# EAGLE schematic TeslaBMS_Shield_5 (EAGLE 7.7.0)
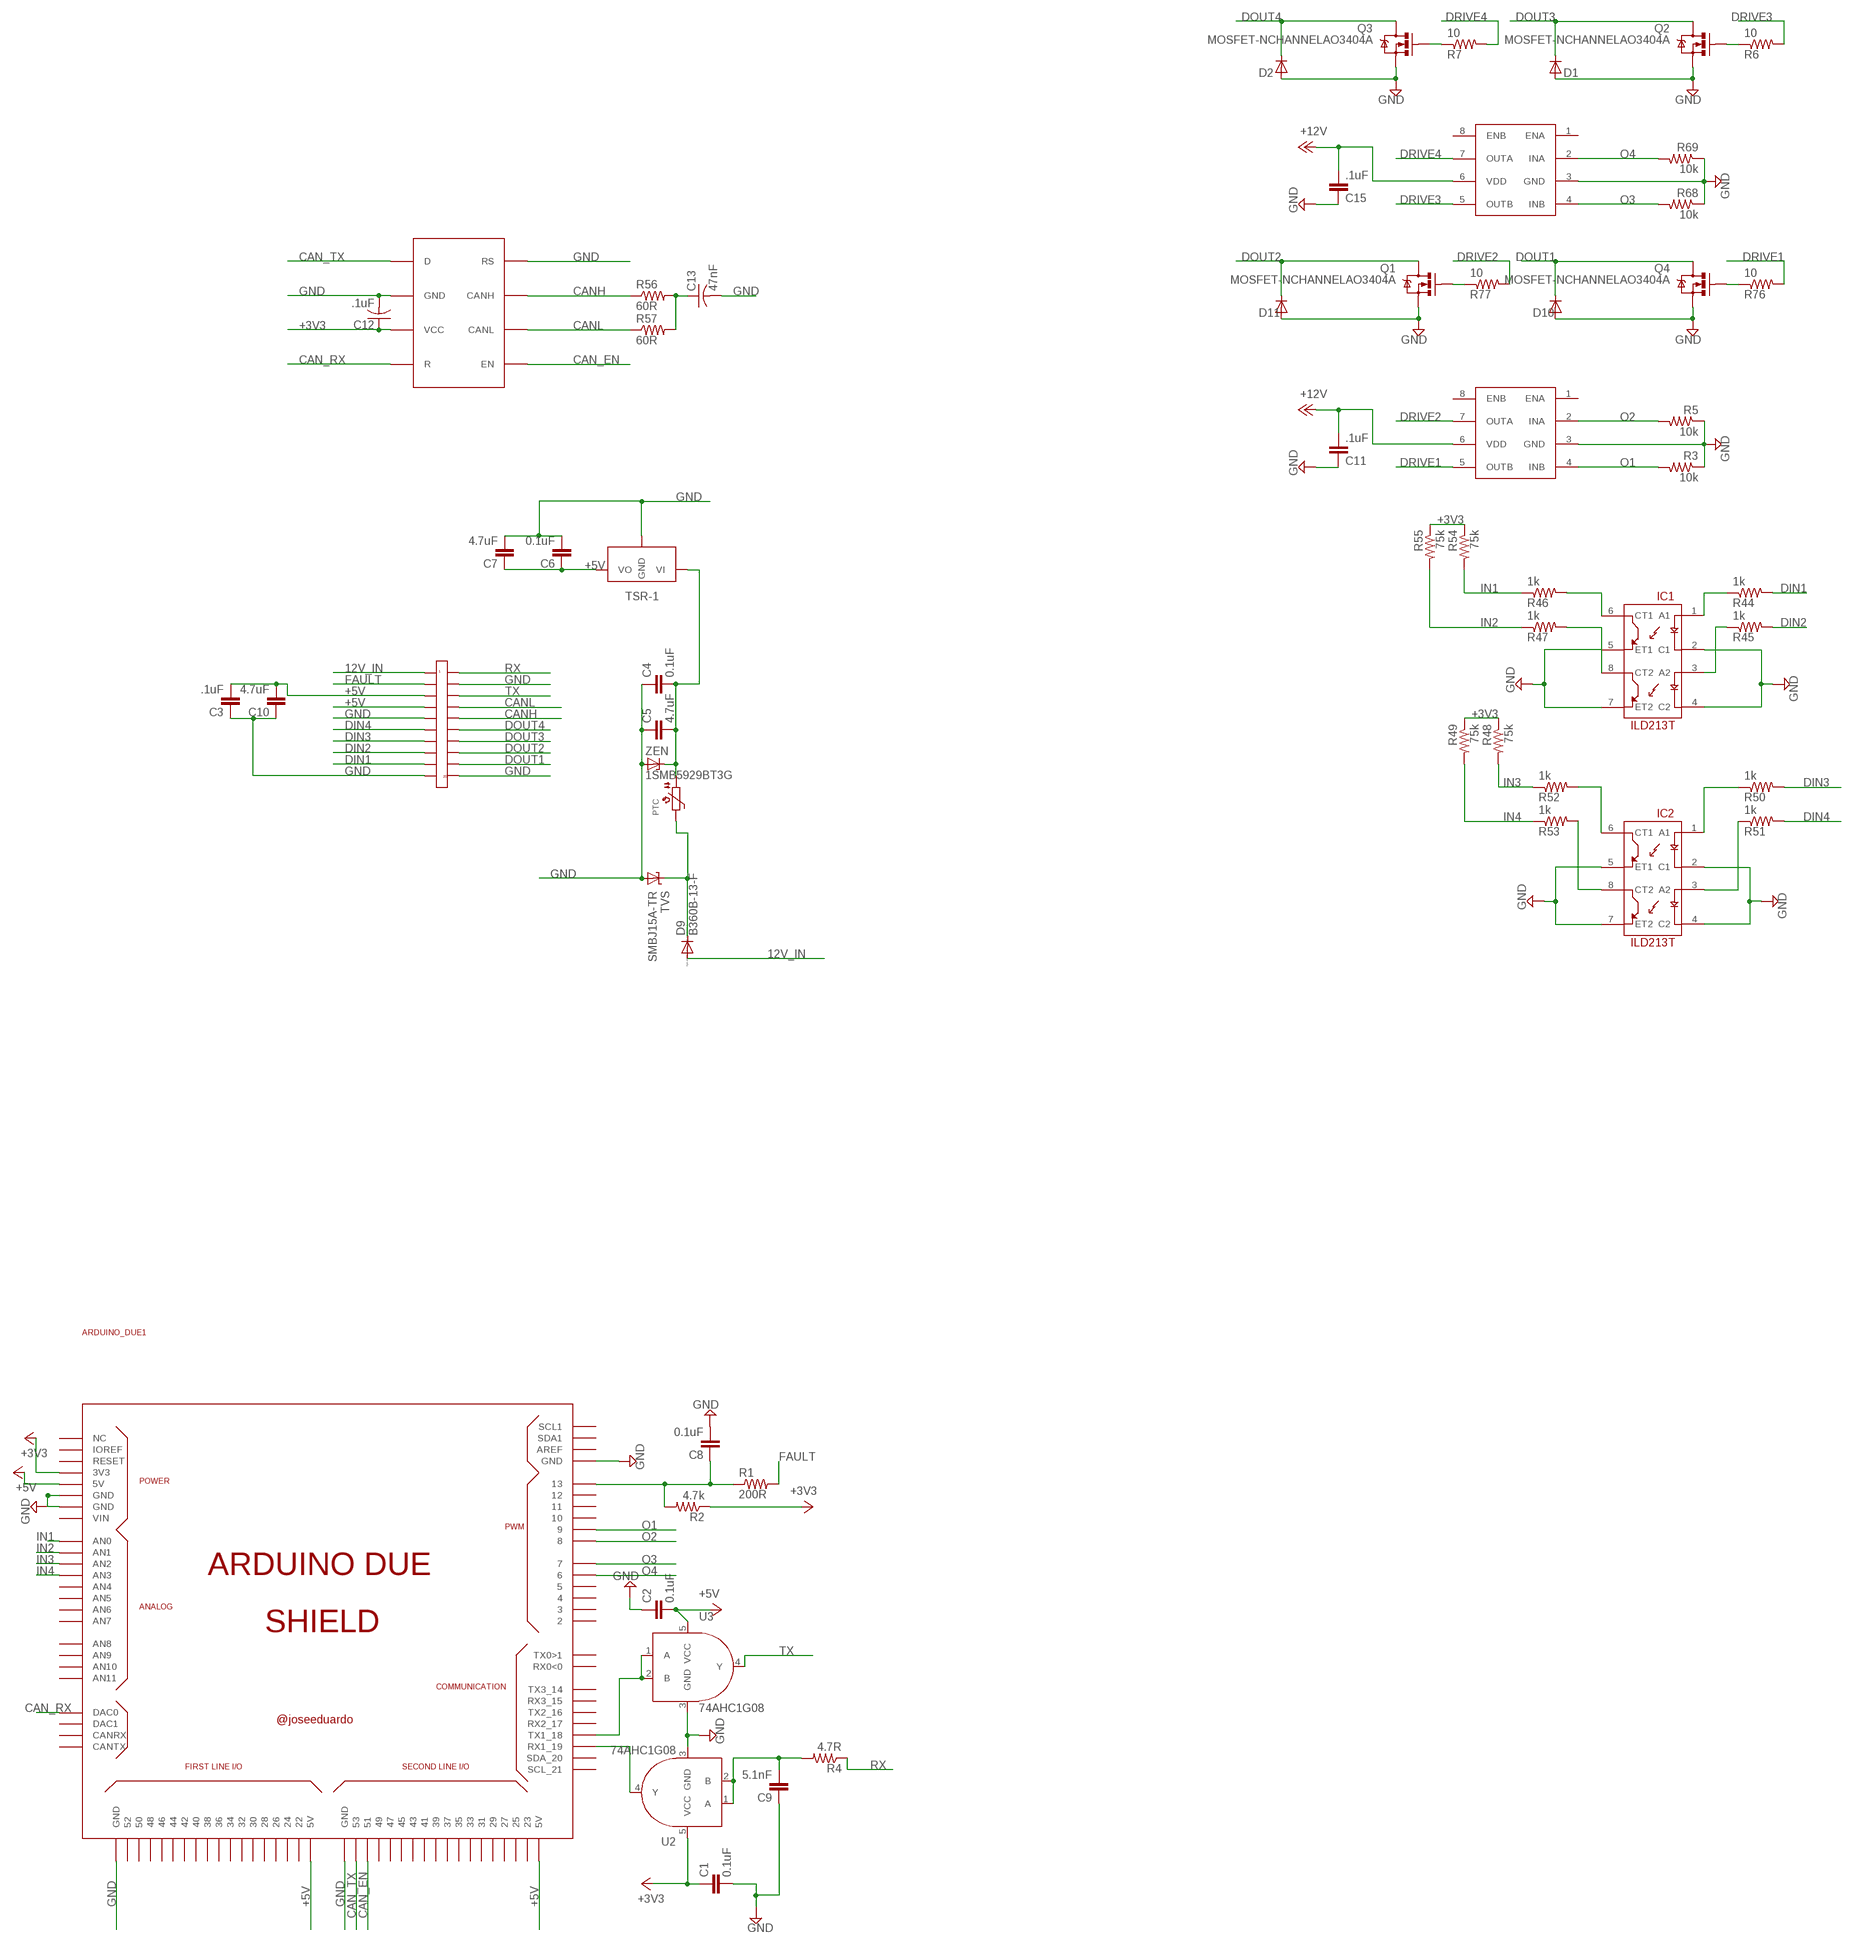
[diagram p0: schematic, sheet 1]

## Parts
ARDUINO_DUE1  ARDUINO_DUE_SHIELD  [ARDUINO_DUE_SHIELD]
C1  0.1uF  CAP0603-CAP  [0603-CAP]
C2  0.1uF  CAP0603-CAP  [0603-CAP]
C3  .1uF  CAP0603-CAP  [0603-CAP]
C4  0.1uF  CAP0805  [0805]
C5  4.7uF  CAP0805  [0805]
C6  0.1uF  CAP0805  [0805]
C7  4.7uF  CAP0805  [0805]
C8  0.1uF  CAP0603-CAP  [0603-CAP]
C9  5.1nF  CAP0603-CAP  [0603-CAP]
C10  4.7uF  CAP0603-CAP  [0603-CAP]
C11  .1uF  CAP0603-CAP  [0603-CAP]
C12  .1uF  C-USC0603  [C0603]
C13  47nF  C-USC0805  [C0805]
C15  .1uF  CAP0603-CAP  [0603-CAP]
D1  MBR0520LT  [SOD123]
D2  MBR0520LT  [SOD123]
D9  B360B-13-F  DIODE-SMB  [SMB]
D10  MBR0520LT  [SOD123]
D11  MBR0520LT  [SOD123]
IC1  ILD213T  [SO08]
IC2  ILD213T  [SO08]
PTC  PTC1812  [PTC1812]
Q1  MOSFET-NCHANNELAO3404A  [SOT23-3]
Q2  MOSFET-NCHANNELAO3404A  [SOT23-3]
Q3  MOSFET-NCHANNELAO3404A  [SOT23-3]
Q4  MOSFET-NCHANNELAO3404A  [SOT23-3]
R1  200R  RESISTOR0603-RES  [0603-RES]
R2  4.7k  RESISTOR0603-RES  [0603-RES]
R3  10k  R-US_R0402  [R0402]
R4  4.7R  RESISTOR0603-RES  [0603-RES]
R5  10k  R-US_R0402  [R0402]
R6  10  R-US_R0402  [R0402]
R7  10  R-US_R0402  [R0402]
R44  1k  RESISTOR0603-RES  [0603-RES]
R45  1k  RESISTOR0603-RES  [0603-RES]
R46  1k  RESISTOR0603-RES  [0603-RES]
R47  1k  RESISTOR0603-RES  [0603-RES]
R48  75k  RESISTOR0603-RES  [0603-RES]
R49  75k  RESISTOR0603-RES  [0603-RES]
R50  1k  RESISTOR0603-RES  [0603-RES]
R51  1k  RESISTOR0603-RES  [0603-RES]
R52  1k  RESISTOR0603-RES  [0603-RES]
R53  1k  RESISTOR0603-RES  [0603-RES]
R54  75k  RESISTOR0603-RES  [0603-RES]
R55  75k  RESISTOR0603-RES  [0603-RES]
R56  60R  R-US_M0805  [M0805]
R57  60R  R-US_M0805  [M0805]
R68  10k  R-US_R0402  [R0402]
R69  10k  R-US_R0402  [R0402]
R76  10  R-US_R0402  [R0402]
R77  10  R-US_R0402  [R0402]
TVS  SMBJ15A-TR  SUPPRESSOR-SMBJ  [SMBJ]
U1  SN65HVD234  [SOIC8]
U2  74AHC1G08  [SOT353]
U3  74AHC1G08  [SOT353]
U4  FAN3227  [SOIC8]
U5  FAN3227  [SOIC8]
U9  TSR-1  [TSR-1]
U$2  VAL-U-LOK-20PIN  [VALULOK-20]
ZEN  1SMB5929BT3G  ZENER-DIODESMB  [SMB]

## Nets
12V_IN: D9.A U$2.P$1
+3V3: ARDUINO_DUE1.3V3 C1.1 C12.1 R2.1 R48.1 R49.1 R54.1 R55.1 U1.PIN3(VCC) U2.5(VCC)
+5V: ARDUINO_DUE1.5V0(5V) ARDUINO_DUE1.5V0_1(5V) ARDUINO_DUE1.5V0_2(5V) C2.2 C3.2 C6.1 C7.1 C10.2 U3.5(VCC) U9.P$3(VO) U$2.P$3 U$2.P$4
+12V: C4.2 C5.2 C11.2 C15.2 PTC.P$1 U4.6(VDD) U5.6(VDD) U9.P$1(VI) ZEN.C
CAN_EN: ARDUINO_DUE1.51 U1.PIN5(EN)
CAN_RX: ARDUINO_DUE1.DAC0 U1.PIN4(R)
CAN_TX: ARDUINO_DUE1.53 U1.PIN1(D)
CANH: R56.1 U1.PIN7(CANH) U$2.P$15
CANL: R57.1 U1.PIN6(CANL) U$2.P$14
DIN1: R44.2 U$2.P$9
DIN2: R45.2 U$2.P$8
DIN3: R50.2 U$2.P$7
DIN4: R51.2 U$2.P$6
DOUT1: D10.C Q4.3(D) U$2.P$19
DOUT2: D11.C Q1.3(D) U$2.P$18
DOUT3: D1.C Q2.3(D) U$2.P$17
DOUT4: D2.C Q3.3(D) U$2.P$16
DRIVE1: R76.2 U5.5(OUTB)
DRIVE2: R77.2 U5.7(OUTA)
DRIVE3: R6.2 U4.5(OUTB)
DRIVE4: R7.2 U4.7(OUTA)
FAULT: R1.2 U$2.P$2
GND: ARDUINO_DUE1.GND ARDUINO_DUE1.GND_1(GND) ARDUINO_DUE1.GND_2(GND) ARDUINO_DUE1.GND_3(GND) ARDUINO_DUE1.GND_4(GND) C1.2 C2.1 C3.1 C4.1 C5.1 C6.2 C7.2 C8.2 C9.1 C10.1 C11.1 C12.2 C13.2 C15.1 D1.A D2.A D10.A D11.A IC1.2(C1) IC1.4(C2) IC1.5(ET1) IC1.7(ET2) IC2.2(C1) IC2.4(C2) IC2.5(ET1) IC2.7(ET2) Q1.2(S) Q2.2(S) Q3.2(S) Q4.2(S) R3.1 R5.1 R68.1 R69.1 TVS.A U1.PIN2(GND) U1.PIN8(RS) U2.3(GND) U3.3(GND) U4.3(GND) U5.3(GND) U9.P$2(GND) U$2.P$5 U$2.P$10 U$2.P$12 U$2.P$20 ZEN.A
IN1: ARDUINO_DUE1.A0(AN0) R46.1 R54.2
IN2: ARDUINO_DUE1.A1(AN1) R47.1 R55.2
IN3: ARDUINO_DUE1.A2(AN2) R48.2 R52.1
IN4: ARDUINO_DUE1.A3(AN3) R49.2 R53.1
N$1: D9.C PTC.P$2 TVS.C
N$2: ARDUINO_DUE1.19(RX1_19) U2.4(Y)
N$3: ARDUINO_DUE1.18(TX1_18) U3.1(A) U3.2(B)
N$4: Q4.1(G) R76.1
N$5: Q2.1(G) R6.1
N$6: IC1.3(A2) R45.1
N$7: ARDUINO_DUE1.13 C8.1 R1.1 R2.2
N$8: Q3.1(G) R7.1
N$9: C9.2 R4.2 U2.1(A) U2.2(B)
N$10: Q1.1(G) R77.1
N$31: IC1.1(A1) R44.1
N$32: IC2.6(CT1) R52.2
N$33: C13.1 R56.2 R57.2
N$36: IC2.8(CT2) R53.2
N$37: IC1.6(CT1) R46.2
N$38: IC1.8(CT2) R47.2
N$41: IC2.1(A1) R50.1
N$42: IC2.3(A2) R51.1
O1: ARDUINO_DUE1.9 R3.2 U5.4(INB)
O2: ARDUINO_DUE1.8 R5.2 U5.2(INA)
O3: ARDUINO_DUE1.7 R68.2 U4.4(INB)
O4: ARDUINO_DUE1.6 R69.2 U4.2(INA)
RX: R4.1 U$2.P$11
TX: U3.4(Y) U$2.P$13
Unconnected: ARDUINO_DUE1.0(RX0<0) ARDUINO_DUE1.1(TX0>1) ARDUINO_DUE1.2 ARDUINO_DUE1.3 ARDUINO_DUE1.4 ARDUINO_DUE1.5 ARDUINO_DUE1.10 ARDUINO_DUE1.11 ARDUINO_DUE1.12 ARDUINO_DUE1.14(TX3_14) ARDUINO_DUE1.15(RX3_15) ARDUINO_DUE1.16(TX2_16) ARDUINO_DUE1.17(RX2_17) ARDUINO_DUE1.20(SDA_20) ARDUINO_DUE1.21(SCL_21) ARDUINO_DUE1.22 ARDUINO_DUE1.23 ARDUINO_DUE1.24 ARDUINO_DUE1.25 ARDUINO_DUE1.26 ARDUINO_DUE1.27 ARDUINO_DUE1.28 ARDUINO_DUE1.29 ARDUINO_DUE1.30 ARDUINO_DUE1.31 ARDUINO_DUE1.32 ARDUINO_DUE1.33 ARDUINO_DUE1.34 ARDUINO_DUE1.35 ARDUINO_DUE1.36 ARDUINO_DUE1.37 ARDUINO_DUE1.38 ARDUINO_DUE1.39 ARDUINO_DUE1.40 ARDUINO_DUE1.41 ARDUINO_DUE1.42 ARDUINO_DUE1.43 ARDUINO_DUE1.44 ARDUINO_DUE1.45 ARDUINO_DUE1.46 ARDUINO_DUE1.47 ARDUINO_DUE1.48 ARDUINO_DUE1.49 ARDUINO_DUE1.50 ARDUINO_DUE1.52 ARDUINO_DUE1.A4(AN4) ARDUINO_DUE1.A5(AN5) ARDUINO_DUE1.A6(AN6) ARDUINO_DUE1.A7(AN7) ARDUINO_DUE1.A8(AN8) ARDUINO_DUE1.A9(AN9) ARDUINO_DUE1.A10(AN10) ARDUINO_DUE1.A11(AN11) ARDUINO_DUE1.AREF ARDUINO_DUE1.CANRX ARDUINO_DUE1.CANTX ARDUINO_DUE1.DAC1 ARDUINO_DUE1.IOREF ARDUINO_DUE1.NC_2(NC) ARDUINO_DUE1.RESET ARDUINO_DUE1.SCL1 ARDUINO_DUE1.SDA1 ARDUINO_DUE1.VIN U4.1(ENA) U4.8(ENB) U5.1(ENA) U5.8(ENB)

## Library data of the parts
ARDUINO_DUE1 = arduino_due_shield:ARDUINO_DUE_SHIELD
C1-C11 C15 = SparkFun-Passives:CAP: Capacitor Standard 0603 ceramic capacitor, and 0.1" leaded capacitor.
C12 C13 = rcl:C-US: CAPACITOR, American symbol
D1 D2 D10 D11 = diode:MBR0520LT: SCHOTTKY BARRIER RECTIFIER Source: http://onsemi.com .. MBR0520LT1-D.pdf
D9 = diode:DIODE-: DIODE
IC1 IC2 = SparkFun-DiscreteSemi:ILD213T: Dual optoisolator.
PTC = microbuilder:PTC: PTC (Resettable Fuse) 1206 Package 250mA PTC (16V Max, Time-to-Trip: 0.08s) - Digikey: F2110CT-ND 1210 Package 100mA PTC (30V Max, Time-to-Trip: 0.6s) - Digikey: MF-USMF010-2CT-ND 1812 Package 750mA PTC (24V Max, Time-to-Trip: 0.2s) - Digikey: MF-MSMF075/24-2CT-ND
Q1-Q4 = SparkFun-DiscreteSemi:MOSFET-NCHANNEL: Common NMOSFET Parts MFG P/N Store ID Prod ID FDD8780 TRANS-09984 SI7820DN TRANS-11055 FDS6630A IC-08089 2N7002PW TRANS-11151 FQP30N06L COM-10213 TRANS-10060 BSS123LT1G TRANS-08345 BSS138 TRANS-00830 BS170 2N7000; PROD_ID: TRAN-12988
R1 R2 R4 R44-R55 = SparkFun-Passives:RESISTOR: Resistor Basic schematic elements and footprints for 0603, 1206, and PTH resistors.
R3 R5-R7 R56 R57 R68 R69 R76 R77 = rcl:R-US_: RESISTOR, American symbol
TVS = diode:SUPPRESSOR-: Suppressor diode
U1 = ck_custom:SN65HVD234
U2 U3 = SparkFun-DigitalIC:74AHC1G08: Single 2-input AND gate; PROD_ID: IC-10841
U4 U5 = collin:FAN3227
U9 = Traco:TSR-1
U$2 = ck_custom:VAL-U-LOK-20PIN
ZEN = diode:ZENER-DIODE: Z-Diode

## Net classes
0 default: width 0.203 mm, drill 0.305 mm, clearance 0.203 mm